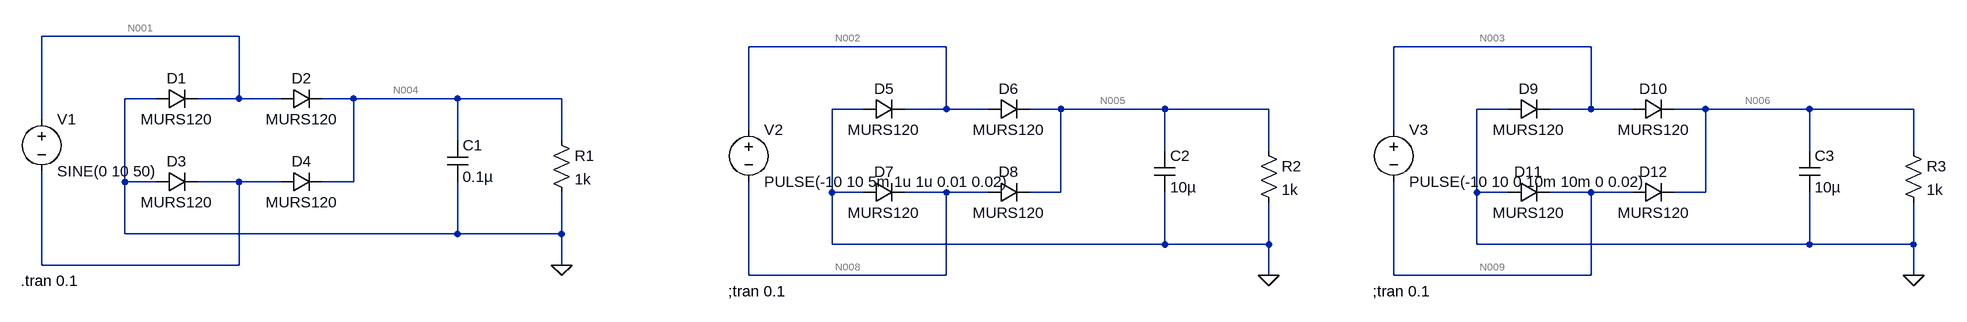
[diagram p0: schematic 4.asc]
4.asc, the LTspice schematic file:
Version 4
SHEET 1 2968 680
WIRE 336 16 32 16
WIRE 1424 32 1120 32
WIRE 2416 32 2112 32
WIRE 208 112 160 112
WIRE 336 112 336 16
WIRE 336 112 272 112
WIRE 400 112 336 112
WIRE 512 112 464 112
WIRE 672 112 512 112
WIRE 832 112 672 112
WIRE 1296 128 1248 128
WIRE 1424 128 1424 32
WIRE 1424 128 1360 128
WIRE 1488 128 1424 128
WIRE 1600 128 1552 128
WIRE 1760 128 1600 128
WIRE 1920 128 1760 128
WIRE 2288 128 2240 128
WIRE 2416 128 2416 32
WIRE 2416 128 2352 128
WIRE 2480 128 2416 128
WIRE 2592 128 2544 128
WIRE 2752 128 2592 128
WIRE 2912 128 2752 128
WIRE 32 144 32 16
WIRE 1120 160 1120 32
WIRE 2112 160 2112 32
WIRE 672 176 672 112
WIRE 832 176 832 112
WIRE 1760 192 1760 128
WIRE 1920 192 1920 128
WIRE 2752 192 2752 128
WIRE 2912 192 2912 128
WIRE 160 240 160 112
WIRE 208 240 160 240
WIRE 336 240 272 240
WIRE 400 240 336 240
WIRE 512 240 512 112
WIRE 512 240 464 240
WIRE 1248 256 1248 128
WIRE 1296 256 1248 256
WIRE 1424 256 1360 256
WIRE 1488 256 1424 256
WIRE 1600 256 1600 128
WIRE 1600 256 1552 256
WIRE 2240 256 2240 128
WIRE 2288 256 2240 256
WIRE 2416 256 2352 256
WIRE 2480 256 2416 256
WIRE 2592 256 2592 128
WIRE 2592 256 2544 256
WIRE 160 320 160 240
WIRE 672 320 672 240
WIRE 672 320 160 320
WIRE 832 320 832 256
WIRE 832 320 672 320
WIRE 1248 336 1248 256
WIRE 1760 336 1760 256
WIRE 1760 336 1248 336
WIRE 1920 336 1920 272
WIRE 1920 336 1760 336
WIRE 2240 336 2240 256
WIRE 2752 336 2752 256
WIRE 2752 336 2240 336
WIRE 2912 336 2912 272
WIRE 2912 336 2752 336
WIRE 32 368 32 224
WIRE 336 368 336 240
WIRE 336 368 32 368
WIRE 832 368 832 320
WIRE 1120 384 1120 240
WIRE 1424 384 1424 256
WIRE 1424 384 1120 384
WIRE 1920 384 1920 336
WIRE 2112 384 2112 240
WIRE 2416 384 2416 256
WIRE 2416 384 2112 384
WIRE 2912 384 2912 336
FLAG 832 368 0
FLAG 1920 384 0
FLAG 2912 384 0
SYMBOL voltage 32 128 R0
WINDOW 123 24 124 Left 2
WINDOW 39 0 0 Left 0
SYMATTR InstName V1
SYMATTR Value SINE(0 10 50)
SYMBOL diode 208 128 R270
WINDOW 0 32 32 VTop 2
WINDOW 3 0 32 VBottom 2
SYMATTR InstName D1
SYMATTR Value MURS120
SYMBOL diode 400 128 R270
WINDOW 0 32 32 VTop 2
WINDOW 3 0 32 VBottom 2
SYMATTR InstName D2
SYMATTR Value MURS120
SYMBOL diode 208 256 R270
WINDOW 0 32 32 VTop 2
WINDOW 3 0 32 VBottom 2
SYMATTR InstName D3
SYMATTR Value MURS120
SYMBOL diode 400 256 R270
WINDOW 0 32 32 VTop 2
WINDOW 3 0 32 VBottom 2
SYMATTR InstName D4
SYMATTR Value MURS120
SYMBOL res 816 160 R0
SYMATTR InstName R1
SYMATTR Value 1k
SYMBOL cap 656 176 R0
SYMATTR InstName C1
SYMATTR Value 0.1µ
SYMBOL voltage 1120 144 R0
WINDOW 123 24 124 Left 2
WINDOW 39 0 0 Left 0
SYMATTR InstName V2
SYMATTR Value PULSE(-10 10 5m 1u 1u 0.01 0.02)
SYMBOL diode 1296 144 R270
WINDOW 0 32 32 VTop 2
WINDOW 3 0 32 VBottom 2
SYMATTR InstName D5
SYMATTR Value MURS120
SYMBOL diode 1488 144 R270
WINDOW 0 32 32 VTop 2
WINDOW 3 0 32 VBottom 2
SYMATTR InstName D6
SYMATTR Value MURS120
SYMBOL diode 1296 272 R270
WINDOW 0 32 32 VTop 2
WINDOW 3 0 32 VBottom 2
SYMATTR InstName D7
SYMATTR Value MURS120
SYMBOL diode 1488 272 R270
WINDOW 0 32 32 VTop 2
WINDOW 3 0 32 VBottom 2
SYMATTR InstName D8
SYMATTR Value MURS120
SYMBOL res 1904 176 R0
SYMATTR InstName R2
SYMATTR Value 1k
SYMBOL cap 1744 192 R0
SYMATTR InstName C2
SYMATTR Value 10µ
SYMBOL voltage 2112 144 R0
WINDOW 123 24 124 Left 2
WINDOW 39 0 0 Left 0
SYMATTR InstName V3
SYMATTR Value PULSE(-10 10 0 10m 10m 0 0.02)
SYMBOL diode 2288 144 R270
WINDOW 0 32 32 VTop 2
WINDOW 3 0 32 VBottom 2
SYMATTR InstName D9
SYMATTR Value MURS120
SYMBOL diode 2480 144 R270
WINDOW 0 32 32 VTop 2
WINDOW 3 0 32 VBottom 2
SYMATTR InstName D10
SYMATTR Value MURS120
SYMBOL diode 2288 272 R270
WINDOW 0 32 32 VTop 2
WINDOW 3 0 32 VBottom 2
SYMATTR InstName D11
SYMATTR Value MURS120
SYMBOL diode 2480 272 R270
WINDOW 0 32 32 VTop 2
WINDOW 3 0 32 VBottom 2
SYMATTR InstName D12
SYMATTR Value MURS120
SYMBOL res 2896 176 R0
SYMATTR InstName R3
SYMATTR Value 1k
SYMBOL cap 2736 192 R0
SYMATTR InstName C3
SYMATTR Value 10µ
TEXT 0 392 Left 2 !.tran 0.1
TEXT 1088 408 Left 2 !;tran 0.1
TEXT 2080 408 Left 2 !;tran 0.1

The netlist it stands for:
* 4.asc
V1 N001 N007 SINE(0 10 50)
D1 0 N001 MURS120
D2 N001 N004 MURS120
D3 0 N007 MURS120
D4 N007 N004 MURS120
R1 N004 0 1k
C1 N004 0 0.1µ
V2 N002 N008 PULSE(-10 10 5m 1u 1u 0.01 0.02)
D5 0 N002 MURS120
D6 N002 N005 MURS120
D7 0 N008 MURS120
D8 N008 N005 MURS120
R2 N005 0 1k
C2 N005 0 10µ
V3 N003 N009 PULSE(-10 10 0 10m 10m 0 0.02)
D9 0 N003 MURS120
D10 N003 N006 MURS120
D11 0 N009 MURS120
D12 N009 N006 MURS120
R3 N006 0 1k
C3 N006 0 10µ
.model D D
.lib standard.dio
.tran 0.1
;tran 0.1
;tran 0.1
.backanno
.end

* Results of the author's LTspice run, read from the files saved beside the schematic
* Operating Point, zero values left out:
*   V(n002) = -554.8 mV
*   V(n008) = 9.445 V
*   V(n005) = 8.89 V
*   V(n003) = -554.8 mV
*   V(n009) = 9.445 V
*   V(n006) = 8.89 V
*   I(D12) = 8.89 mA
*   I(D11) = -33.81 nA
*   I(D10) = -33.81 nA
*   I(D9) = 8.89 mA
*   I(D8) = 8.89 mA
*   I(D7) = -33.81 nA
*   I(D6) = -33.81 nA
*   I(D5) = 8.89 mA
*   I(R3) = 8.89 mA
*   I(R2) = 8.89 mA
*   I(V3) = 8.891 mA
*   I(V2) = 8.891 mA
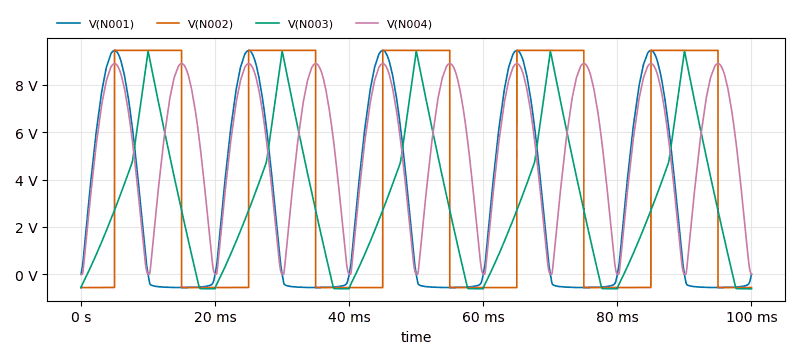
[diagram p1: Transient Analysis of 4.asc, plotted from the saved traces]
* Transient Analysis, 1 run:
*   V(N001): min -554.8 mV, max 9.445 V, average 2.671 V, rms 4.672 V, last 7.839 mV
*   V(N002): min -555.2 mV, max 9.445 V, average 4.446 V, rms 6.691 V, last -554.8 mV
*   V(N003): min -607.4 mV, max 9.393 V, average 3.138 V, rms 4.323 V, last -607.4 mV
*   V(N004): min 0 V, max 8.89 V, average 5.34 V, rms 6.11 V, last 15.68 mV